# EAGLE board BORC_v2_control_board (EAGLE 9.6.2)
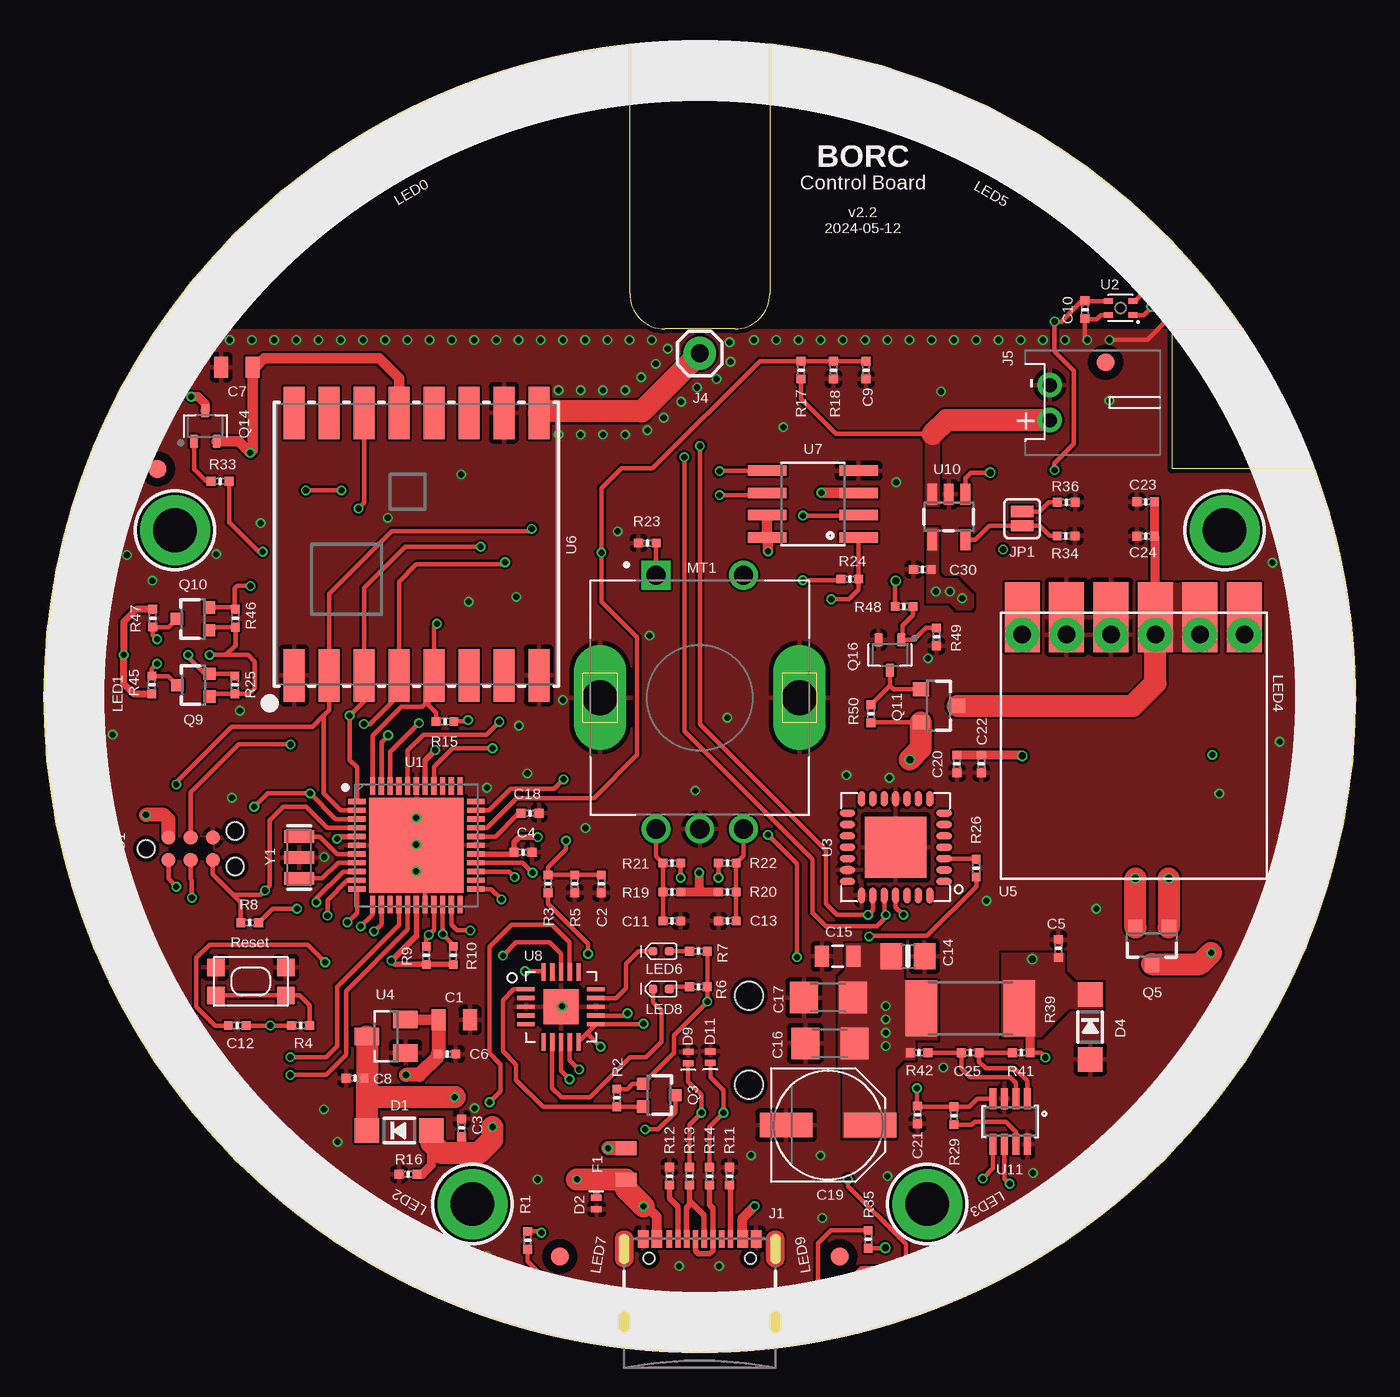
[diagram p4: board, top side]
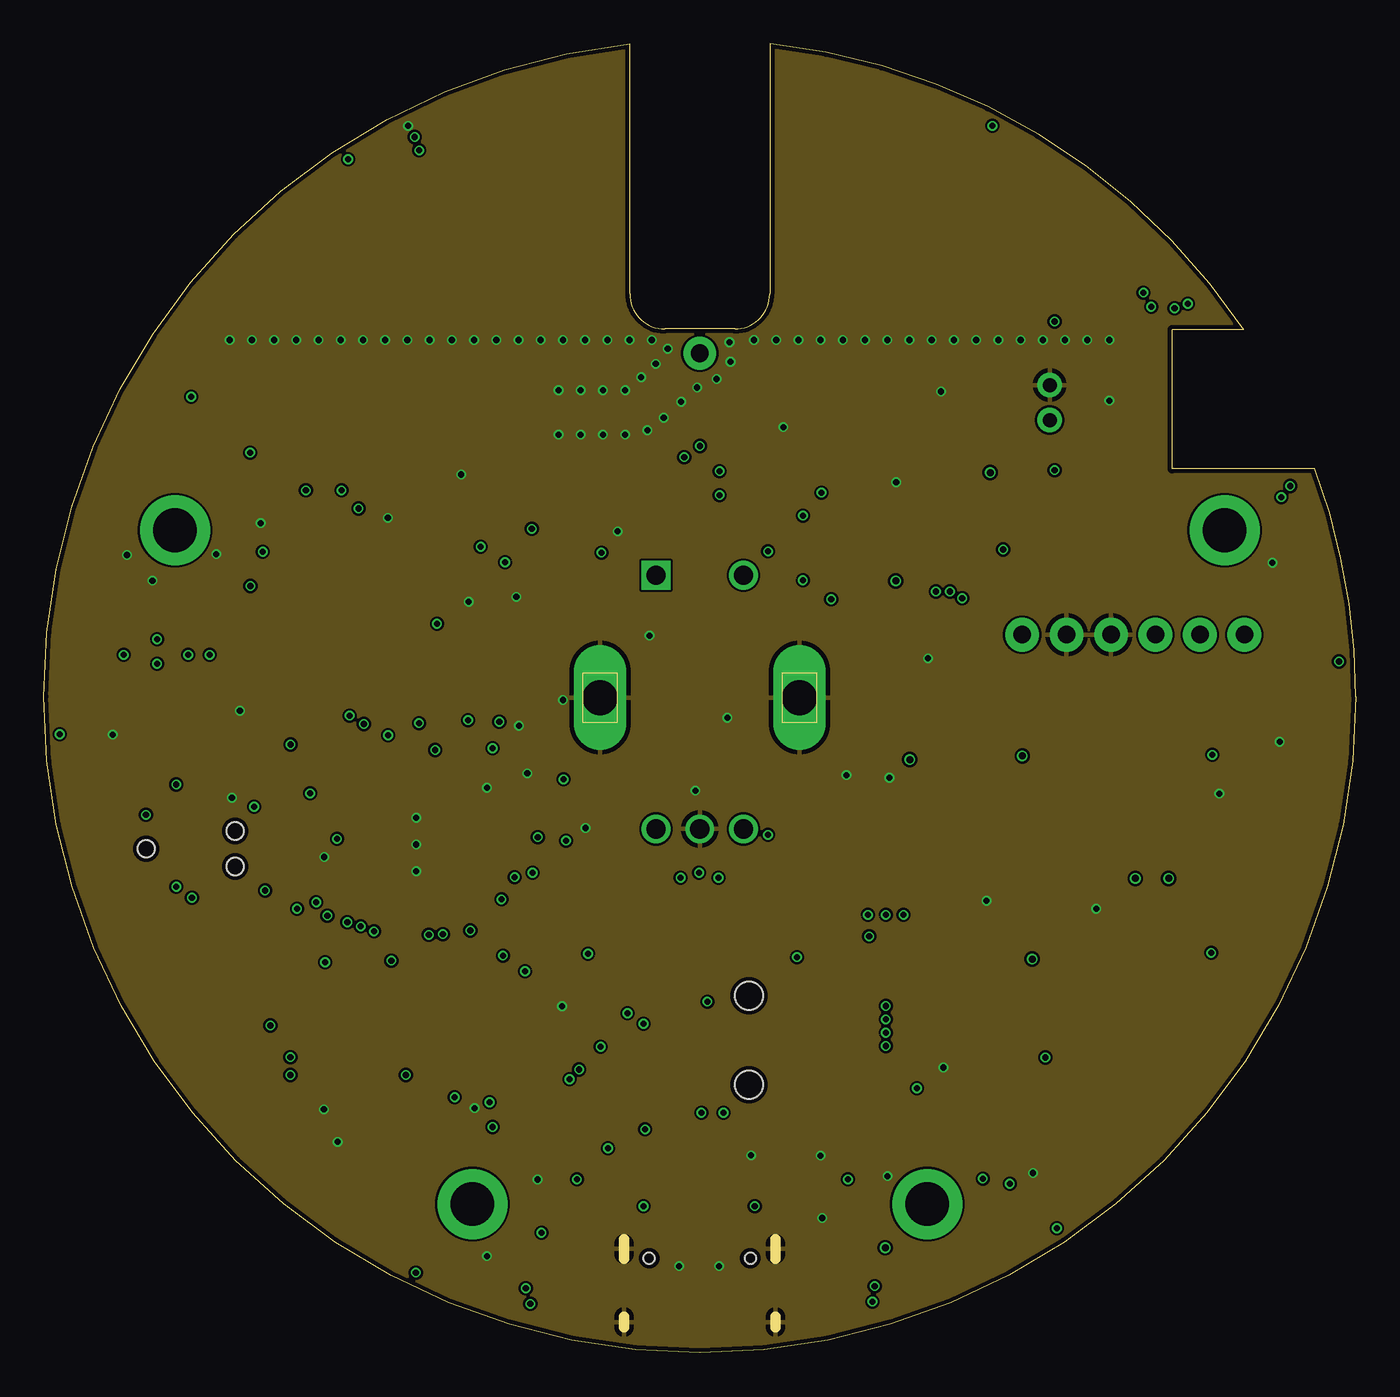
[diagram p5: board, inner layer Ground]
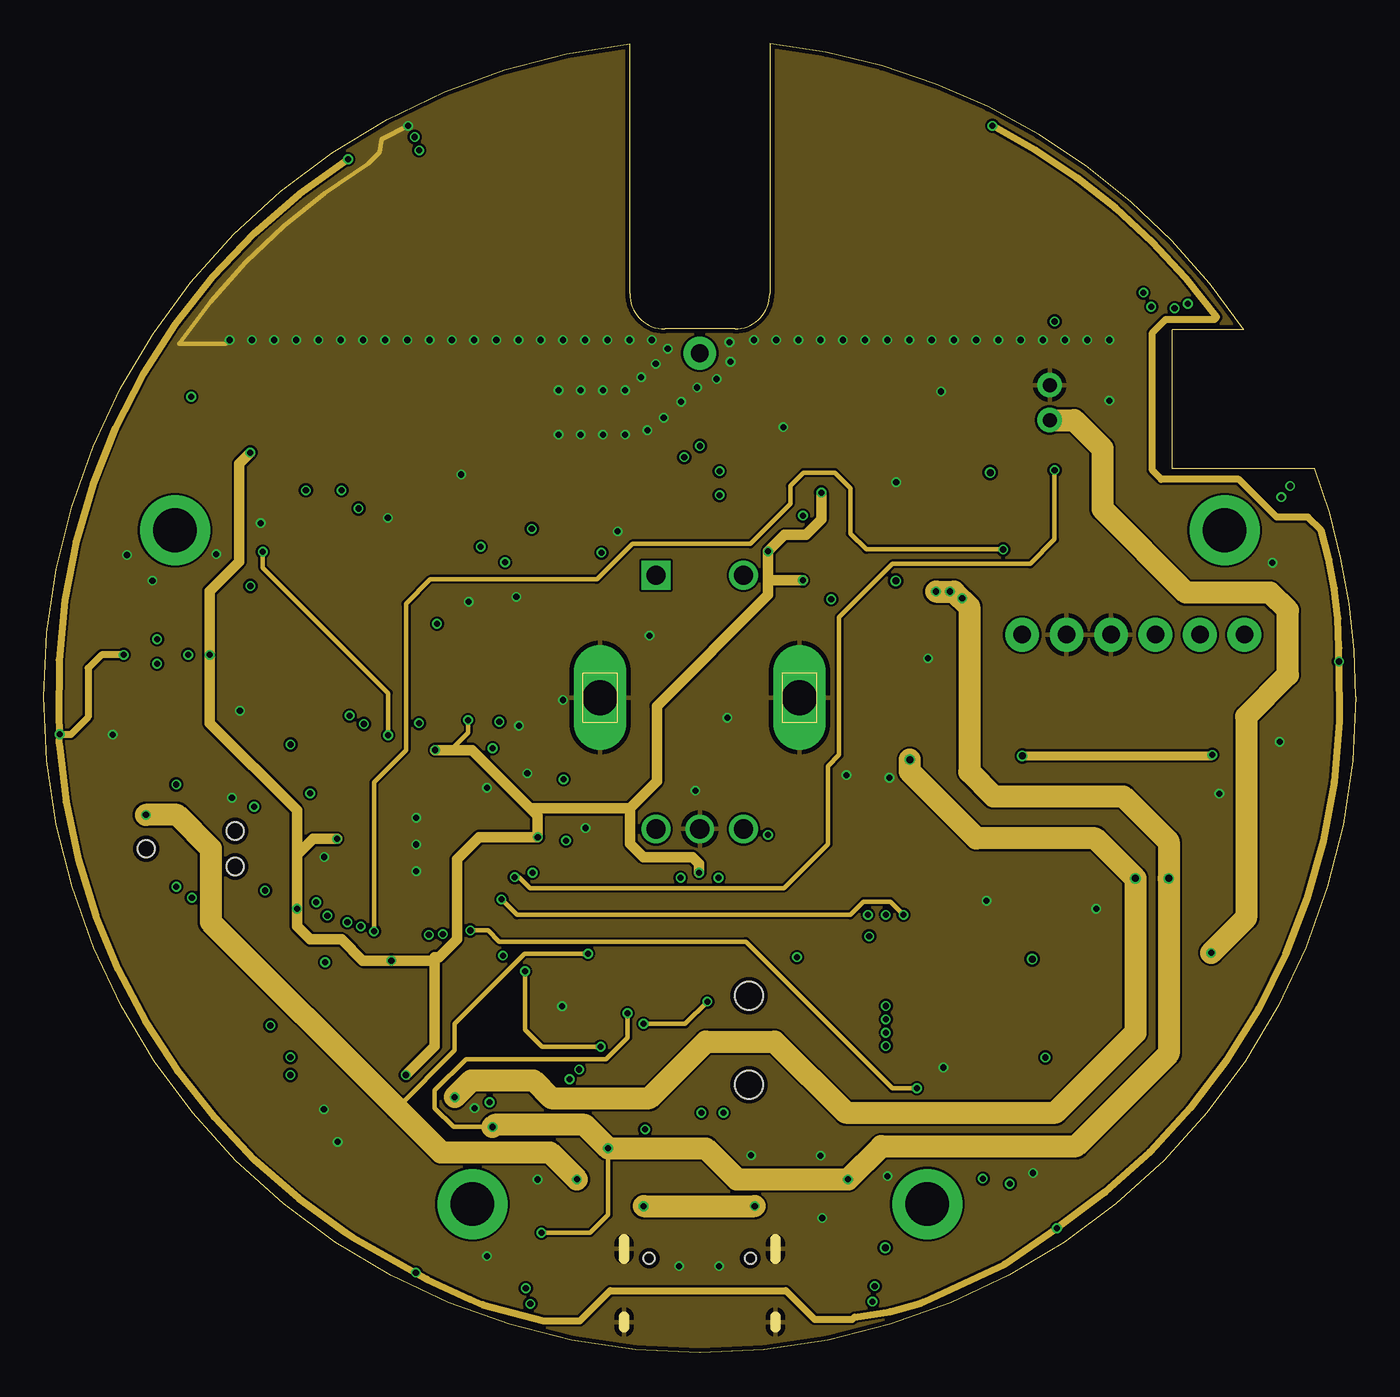
[diagram p6: board, inner layer Power]
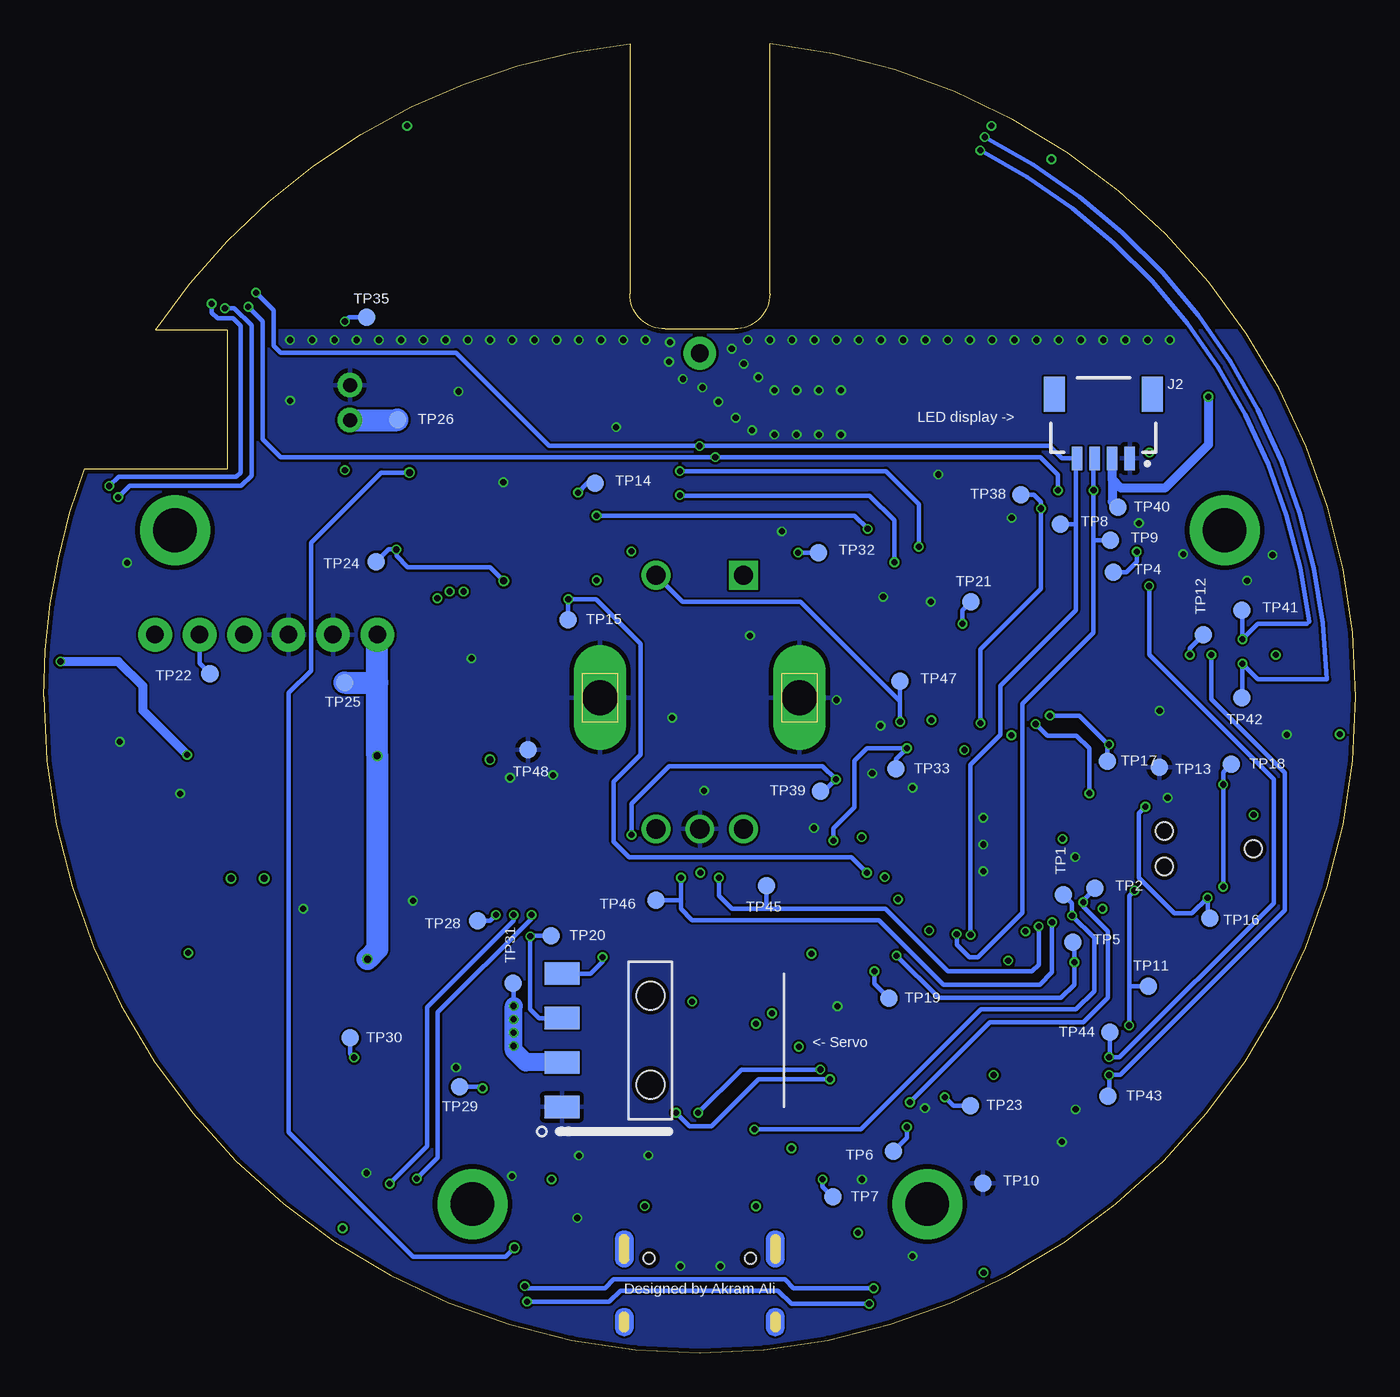
[diagram p7: board, bottom side, seen from below]

Size 75 x 74.8 mm. Coordinates in mm from the lower left corner, seen from the top.
Outline: 41.5,74.8 41.5,60.5 arc-90 39.5,58.5 35.5,58.5 arc-90 33.5,60.5 33.5,74.8 arc84 0,37.5 arc180 75,37.5 arc20 72.67,50.51 64.5,50.51 64.5,58.46 68.6,58.46 arc50 41.5,74.8
Copper layers (1*2*15*16): Top 0.035559375mm / dielectric 0.17018125mm / Ground 0.01778125mm / dielectric 47mil / Power 0.01778125mm / dielectric 0.17018125mm / Bottom 0.035559375mm
Design rules "oshpark-4layer *": minimum track width 5mil, minimum drill 10mil, track to track 5mil, track to pad 5mil, pad to pad 5mil, via to via 5mil, smd to smd 5mil, copper to edge 10mil, drill to drill 6mil, minimum pad ring 4mil, minimum via ring 4mil, stop-mask expansion 5mil, vias tented up to drill 15mil, thermal gap 10mil
Net classes: 0 default: width 0.152 mm, drill 0.305 mm, clearance 0.152 mm; 1 power: width 0.127 mm, clearance 0.127 mm
tRestrict: area 5.5,58.5 to 69.5,75.5
bRestrict: area 5.5,58.5 to 69.5,75.5

## Footprints (pad centres in the part's own frame; a part is rotated, then mirrored left to right if it is on the bottom)
0805 = smd 0.8 x 1.2: 1 -0.9,0; 2 0.9,0
MICROBUILDER__0402MP = smd 0.5 x 0.5: 1 -0.508,0; 2 0.508,0
0805-NO = smd 1.24 x 1.5: 1 -0.95,0; 2 0.95,0
1206 = smd 1.6 x 1.8: 1 -1.4,0; 2 1.4,0
PANASONIC_D = smd 3 x 1.4: + 2.4,0; - -2.4,0
SOD-123 = smd 1.4 x 1.4: A 1.85,0; C -1.85,0
0402 = smd 0.35 x 0.6: A -0.325,0; C 0.325,0
FIDUCIAL_1MM = smd 1 x 1: 1 0,0
USB-C-16P-2LAYER-PADS = smd 0.3 x 1: A5 -1.25,-0.34; A6 -0.25,-0.34; A7 0.25,-0.34; A8 1.25,-0.34; B5 1.75,-0.34; B6 0.75,-0.34; B7 -0.75,-0.34; B8 -1.75,-0.34 | smd 0.6 x 1: GND -3.225,-0.34; GND2 3.225,-0.34; VBUS1 -2.45,-0.34; VBUS2 2.45,-0.34 | drill 0.4 pad 0.6 long: SHLD1 -4.318,-0.915; SHLD2 4.318,-0.915; SHLD3 -4.318,-5.095; SHLD4 4.318,-5.095 | hole 0.65: -2.89,-1.445; 2.89,-1.445
JST04_1MM_RA = smd 0.6 x 1.35: 1 -1.5,0; 2 -0.5,0; 3 0.5,0; 4 1.5,0 | smd 1.2 x 2: NC1 2.8,-3.675; NC2 -2.8,-3.675
M20-8900405 = smd 1.27 x 2: P$1 -3.81,0; P$2 -1.27,0; P$3 1.27,0; P$4 3.81,0 | hole 1.6: -2.54,-5.07; 2.54,-5.07
1X01 = drill 1.016 pad 1.88: 1 0,0
JST-PH-2-THM-RA = drill 0.8 pad 1.422: 1 1,0; 2 -1,0
SMT-JUMPER_2_NC_PASTE_SILK = smd 0.635 x 1.27: 1 -0.406,0; 2 0.406,0
APA102_2020 = smd 0.7 x 0.35: 1 -0.95,-0.75; 2 -0.95,0; 3 -0.95,0.75; 4 0.95,0.75; 5 0.95,0; 6 0.95,-0.75
LED-0402 = smd 0.5 x 0.5: + -0.463,0; - 0.463,0
XDCR_PEC11R-4215F-S0024 = drill 1.1 square: 1 -2.5,7 | drill 1.1: 2 2.5,7; A -2.5,-7.5; B 2.5,-7.5; COM 0,-7.5 | drill 2 long: S1 -5.7,0; S2 5.7,0
SOT323 = smd 0.7 x 0.7: 1 -0.65,-0.925; 2 0.65,-0.925; 3 0,0.925
SOT23-3 = smd 0.8 x 0.9: 1 -0.95,-1; 2 0.95,-1; 3 0,1.1
SOT65P210X100-3N-PNP = smd 0.75 x 0.5: 1 -0.87,-0.65; 2 -0.87,0.65; 3 0.87,0
SOT65P210X100-3N = smd 0.75 x 0.5: 1 -0.87,0.65; 2 -0.87,-0.65; 3 0.87,0
2512 = smd 1.8 x 3.2: 1 -2.8,0; 2 2.8,0
KMR2 = smd 1 x 1: 1 2,0.8; 2 2,-0.8; 3 -2,0.8; 4 -2,-0.8
TC2030-IDC-NL = smd 0.787 x 0.787: 1 -1.27,-0.635; 2 -1.27,0.635; 3 0,-0.635; 4 0,0.635; 5 1.27,-0.635; 6 1.27,0.635 | hole 0.991: -2.54,0; 2.54,1.016; 2.54,-1.016
MICROBUILDER_TESTPOINT_ROUND_1MM = smd 1 x 1: P$1 0,0
QFN50P700X700X100-45N = smd 1 x 0.3: 1 -3.4,2.5; 2 -3.4,2; 3 -3.4,1.5; 4 -3.4,1; 5 -3.4,0.5; 6 -3.4,0; 7 -3.4,-0.5; 8 -3.4,-1; 9 -3.4,-1.5; 10 -3.4,-2; 11 -3.4,-2.5; 23 3.4,-2.5; 24 3.4,-2; 25 3.4,-1.5; 26 3.4,-1; 27 3.4,-0.5; 28 3.4,0; 29 3.4,0.5; 30 3.4,1; 31 3.4,1.5; 32 3.4,2; 33 3.4,2.5 | smd 0.3 x 1: 12 -2.5,-3.4; 13 -2,-3.4; 14 -1.5,-3.4; 15 -1,-3.4; 16 -0.5,-3.4; 17 0,-3.4; 18 0.5,-3.4; 19 1,-3.4; 20 1.5,-3.4; 21 2,-3.4; 22 2.5,-3.4; 34 2.5,3.4; 35 2,3.4; 36 1.5,3.4; 37 1,3.4; 38 0.5,3.4; 39 0,3.4; 40 -0.5,3.4; 41 -1,3.4; 42 -1.5,3.4; 43 -2,3.4; 44 -2.5,3.4 | smd 5.4 x 5.4: 45 0,0
SHT4X = smd 0.5 x 0.3: 1 -0.7,0.4; 2 -0.7,-0.4; 3 0.7,-0.4; 4 0.7,0.4
HVQFN28_SOT788-1 = smd 0.9 x 0.4: 1 1.035,5.76; 2 1.035,5.11; 3 1.035,4.46; 4 1.035,3.81; 5 1.035,3.16; 6 1.035,2.51; 7 1.035,1.86; 15 6.56,1.86; 16 6.56,2.51; 17 6.56,3.16; 18 6.56,3.81; 19 6.56,4.46; 20 6.56,5.11; 21 6.56,5.76 | smd 0.4 x 0.9: 8 1.86,1.035; 9 2.51,1.035; 10 3.16,1.035; 11 3.81,1.035; 12 4.46,1.035; 13 5.11,1.035; 14 5.76,1.035; 22 5.76,6.56; 23 5.11,6.56; 24 4.46,6.56; 25 3.81,6.56; 26 3.16,6.56; 27 2.51,6.56; 28 1.86,6.56 | smd 3.5 x 3.5: TH 3.81,3.81
SOT23 = smd 1 x 1.4: 1 -0.95,-1.1; 2 0.95,-1.1; 3 0,1.1
POLOLU_STEPUP_U3V40X = drill 1 pad 1.93: EN 1.27,1.27; GND@1 8.89,1.27; GND@2 11.43,1.27; VIN@1 3.81,1.27; VIN@2 6.35,1.27; VOUT 13.97,1.27 | smd 2 x 4: P$1 1.27,0.27; P$2 3.81,0.27; P$3 6.35,0.27; P$4 8.89,0.27; P$5 11.43,0.27; P$6 13.97,0.27
RFM69HCW-XXXS2 = smd 3 x 1.2: 1 -7.5,7; 2 -7.5,5; 3 -7.5,3; 4 -7.5,1; 5 -7.5,-1; 6 -7.5,-3; 7 -7.5,-5; 8 -7.5,-7; 9 7.5,-7; 10 7.5,-5; 11 7.5,-3; 12 7.5,-1; 13 7.5,1; 14 7.5,3; 15 7.5,5; 16 7.5,7
SO08 = smd 0.61 x 2.21: 1_CS -1.905,-2.616; 2_SO -0.635,-2.616; 3_WP 0.635,-2.616; 4_GND 1.905,-2.616; 5_SI 1.905,2.616; 6_SCK 0.635,2.616; 7_HOLD -0.635,2.616; 8_VCC -1.905,2.616
FTDI_FT231XQ-R_PACKAGE = smd 0.25 x 1: 3V3OUT 0.968,-2.032; CBUS2 -0.532,-2.032; CBUS3 0.968,1.968; CTS# -1.032,-2.032; DTR# -0.032,1.968; RTS# -0.532,1.968; TXD 0.468,1.968; USBDM 0.468,-2.032; USBDP -0.032,-2.032; VCCIO -1.032,1.968 | smd 1 x 0.25: CBUS0 1.968,0.968; CBUS1 1.968,0.468; DCD# -2.032,-1.032; DSR# -2.032,-0.532; GND_PIN3 -2.032,-0.032; GND_PIN13 1.968,-0.032; RESET# 1.968,-1.032; RI# -2.032,0.468; RXD -2.032,0.968; VCC 1.968,-0.532 | smd 2 x 2: GND_PIN21 -0.032,-0.032
SOT23-5 = smd 0.55 x 1.2: 1 -0.95,-1.3; 2 0,-1.3; 3 0.95,-1.3; 4 0.95,1.3; 5 -0.95,1.3
SOT23-8 = smd 0.4 x 1.2: 1 -0.975,-1.3; 2 -0.325,-1.3; 3 0.325,-1.3; 4 0.975,-1.3; 5 0.975,1.3; 6 0.325,1.3; 7 -0.325,1.3; 8 -0.975,1.3
MICROBUILDER_MOUNTINGHOLE_2.5_PLATED_THICK = drill 2.5 pad 4: P$1 0,0
RESONATOR-SMD = smd 0.7 x 1.7: 1 -1.2,0; 2 0,0; 3 1.2,0

## Placement (x,y rotation side)
C1  0.33µF  [0805]  23.46,19.03 0 top
C2  0.1uF  [MICROBUILDER__0402MP]  31.88,26.8 270 top
C3  0.1uF  [MICROBUILDER__0402MP]  23.89,12.86 90 top
C4  0.1uF  [MICROBUILDER__0402MP]  27.4,28.6 0 top
C5  0.1uF  [MICROBUILDER__0402MP]  58,23.1 90 top
C6  0.1uF  [MICROBUILDER__0402MP]  23.05,17.06 0 top
C7  0.33µF  [0805]  11.03,56.33 0 top
C8  10uF  [MICROBUILDER__0402MP]  17.79,15.69 180 top
C9  0.1uF  [MICROBUILDER__0402MP]  47,56.16 270 top
C10  0.1uF  [MICROBUILDER__0402MP]  59.52,59.61 270 top
C11  0.1uF  [MICROBUILDER__0402MP]  35.9,24.68 180 top
C12  0.1uF  [MICROBUILDER__0402MP]  11.06,18.7 0 top
C13  0.1uF  [MICROBUILDER__0402MP]  39.08,24.68 0 top
C14  0.1uF  [0805-NO]  49.4,22.66 0 top
C15  10uF  [0805]  45.39,22.65 180 top
C16  2.2uF  [1206]  44.93,17.68 180 top
C17  2.2uF  [1206]  44.85,20.29 180 top
C18  0.1uF  [MICROBUILDER__0402MP]  27.8,30.83 180 top
C19  100uF  [PANASONIC_D]  44.84,13.01 0 top
C20  10uF  [MICROBUILDER__0402MP]  52.2,33.66 270 top
C21  0.1uF  [MICROBUILDER__0402MP]  49.95,13.6 90 top
C22  10uF  [MICROBUILDER__0402MP]  53.59,33.66 270 top
C23  10uF  [MICROBUILDER__0402MP]  62.99,48.62 180 top
C24  10uF  [MICROBUILDER__0402MP]  62.99,46.66 180 top
C25  0.1uF  [MICROBUILDER__0402MP]  52.96,17.14 180 top
C30  10uF  [MICROBUILDER__0402MP]  50.22,44.76 180 top
D1  STPS140Z  [SOD-123]  20.32,12.7 0 top
D2  SP0402U-ULC-01ETG  [0402]  31.59,8.52 90 top
D4  MBR260HW  [SOD-123]  59.83,18.62 270 top
D9  SP0402U-ULC-01ETG  [0402]  36.83,16.87 270 top
D11  SP0402U-ULC-01ETG  [0402]  38.1,16.89 270 top
F1  6V 1.1A  [0805]  33.28,10.79 90 top
FID1  FIDUCIAL""  [FIDUCIAL_1MM]  45.5,5.5 0 top
FID2  FIDUCIAL""  [FIDUCIAL_1MM]  29.5,5.5 0 top
FID3  FIDUCIAL""  [FIDUCIAL_1MM]  6.5,50.5 0 top
FID4  FIDUCIAL""  [FIDUCIAL_1MM]  60.7,56.6 0 top
J1  USB Female Type C Connector  [USB-C-16P-2LAYER-PADS]  37.5,6.85 0 top
J2  QWIIC_RIGHT_ANGLE  [JST04_1MM_RA]  14.42,51.1 180 bottom
J3  M20-8900405  [M20-8900405]  45.38,17.86 90 bottom
J4  [1X01]  37.5,57.11 0 top
J5  [JST-PH-2-THM-RA]  57.5,54.3 270 top
JP1  JUMPER-SMT_2_NC_PASTE_SILK  [SMT-JUMPER_2_NC_PASTE_SILK]  55.93,47.66 270 top
LED0  APA102  [APA102_2020]  19.46,68.52 30 top
LED1  APA102  [APA102_2020]  1.67,37.52 90 top
LED2  APA102  [APA102_2020]  19.73,6.36 150 top
LED3  APA102  [APA102_2020]  55.38,6.4 210 top
LED4  APA102  [APA102_2020]  73.26,37.54 270 top
LED5  APA102  [APA102_2020]  55.63,68.46 330 top
LED6  RED  [LED-0402]  35.29,22.94 180 top
LED7  RED  [LED-0402]  30.23,1.45 350 top
LED8  GREEN  [LED-0402]  35.29,20.79 180 top
LED9  YELLOW  [LED-0402]  44.7,1.47 190 top
MT1  PEC11R-4215F-S0024  [XDCR_PEC11R-4215F-S0024]  37.5,37.43 0 top
Q3  BSS138PW,115  [SOT323]  35.18,14.72 270 top
Q5  SSM3J374R,LF  [SOT23-3]  63.35,23.3 180 top
Q9  BSS138PW,115  [SOT323]  8.56,38.15 90 top
Q10  BSS138PW,115  [SOT323]  8.54,41.94 90 top
Q11  SSM3J374R,LF  [SOT23-3]  51.14,36.97 270 top
Q14  UMT3906T106  [SOT65P210X100-3N-PNP]  9.24,52.95 90 top
Q16  UMT3904T106  [SOT65P210X100-3N]  48.37,39.87 270 top
R1  1K  [MICROBUILDER__0402MP]  27.66,6.42 270 top
R2  10K  [MICROBUILDER__0402MP]  32.76,14.56 270 top
R3  10M  [MICROBUILDER__0402MP]  28.83,26.8 270 top
R4  100  [MICROBUILDER__0402MP]  14.69,18.7 0 top
R5  10M  [MICROBUILDER__0402MP]  30.35,26.8 270 top
R6  1K  [MICROBUILDER__0402MP]  37.42,20.91 180 top
R7  1K  [MICROBUILDER__0402MP]  37.42,22.95 180 top
R8  10K  [MICROBUILDER__0402MP]  11.77,24.58 0 top
R9  4.7K  [MICROBUILDER__0402MP]  21.87,22.7 270 top
R10  4.7K  [MICROBUILDER__0402MP]  23.41,22.7 270 top
R11  5.1K  [MICROBUILDER__0402MP]  39.2,10.1 90 top
R12  5.1K  [MICROBUILDER__0402MP]  35.77,10.1 90 top
R13  27  [MICROBUILDER__0402MP]  36.92,10.1 270 top
R14  27  [MICROBUILDER__0402MP]  38.06,10.1 270 top
R15  10K  [MICROBUILDER__0402MP]  22.94,36.07 180 top
R16  10K  [MICROBUILDER__0402MP]  20.82,10.2 180 top
R17  10M  [MICROBUILDER__0402MP]  43.29,56.16 270 top
R18  10M  [MICROBUILDER__0402MP]  45.15,56.16 270 top
R19  10K  [MICROBUILDER__0402MP]  35.9,26.33 180 top
R20  10K  [MICROBUILDER__0402MP]  39.08,26.33 0 top
R21  10K  [MICROBUILDER__0402MP]  35.9,27.98 0 top
R22  10K  [MICROBUILDER__0402MP]  39.08,27.98 180 top
R23  10K  [MICROBUILDER__0402MP]  34.5,46.27 180 top
R24  10K  [MICROBUILDER__0402MP]  46.08,44.21 0 top
R25  10K  [MICROBUILDER__0402MP]  10.93,38.16 90 top
R26  220  [MICROBUILDER__0402MP]  53.3,27.69 90 top
R29  10K  [MICROBUILDER__0402MP]  52.03,13.54 270 top
R33  1K  [MICROBUILDER__0402MP]  10.09,49.8 0 top
R34  2K  [MICROBUILDER__0402MP]  58.43,46.67 180 top
R35  10K  [MICROBUILDER__0402MP]  47.13,6.48 270 top
R36  2K  [MICROBUILDER__0402MP]  58.45,48.6 180 top
R39  0.1/1%/2W  [2512]  52.96,19.68 0 top
R41  10  [MICROBUILDER__0402MP]  55.88,17.14 180 top
R42  10  [MICROBUILDER__0402MP]  50.04,17.14 0 top
R45  10K  [MICROBUILDER__0402MP]  6.18,38.16 90 top
R46  10K  [MICROBUILDER__0402MP]  10.96,41.97 90 top
R47  10K  [MICROBUILDER__0402MP]  6.23,41.98 270 top
R48  1K  [MICROBUILDER__0402MP]  49.17,42.64 180 top
R49  10K  [MICROBUILDER__0402MP]  51.03,40.91 270 top
R50  10K  [MICROBUILDER__0402MP]  47.28,36.52 90 top
SW1  SPST_TACT-KMR2  [KMR2]  11.84,21.22 180 top
TC1  TC2030-IDC-NL  [TC2030-IDC-NL]  8.4,28.8 0 top
TP1  TX  [MICROBUILDER_TESTPOINT_ROUND_1MM]  16.71,26.18 90 bottom
TP2  RX  [MICROBUILDER_TESTPOINT_ROUND_1MM]  14.91,26.53 0 bottom
TP4  RX  [MICROBUILDER_TESTPOINT_ROUND_1MM]  13.85,44.61 0 bottom
TP5  RX  [MICROBUILDER_TESTPOINT_ROUND_1MM]  16.18,23.46 0 bottom
TP6  RX  [MICROBUILDER_TESTPOINT_ROUND_1MM]  26.43,11.51 180 bottom
TP7  RX  [MICROBUILDER_TESTPOINT_ROUND_1MM]  29.89,8.9 0 bottom
TP8  RX  [MICROBUILDER_TESTPOINT_ROUND_1MM]  16.88,47.35 0 bottom
TP9  RX  [MICROBUILDER_TESTPOINT_ROUND_1MM]  14.02,46.42 0 bottom
TP10  RX  [MICROBUILDER_TESTPOINT_ROUND_1MM]  21.32,9.68 0 bottom
TP11  RX  [MICROBUILDER_TESTPOINT_ROUND_1MM]  11.86,20.94 0 bottom
TP12  RX  [MICROBUILDER_TESTPOINT_ROUND_1MM]  8.71,41.04 90 bottom
TP13  RX  [MICROBUILDER_TESTPOINT_ROUND_1MM]  11.23,33.45 0 bottom
TP14  RX  [MICROBUILDER_TESTPOINT_ROUND_1MM]  43.5,49.67 0 bottom
TP15  RX  [MICROBUILDER_TESTPOINT_ROUND_1MM]  45.03,41.88 0 bottom
TP16  RX  [MICROBUILDER_TESTPOINT_ROUND_1MM]  8.35,24.82 0 bottom
TP17  RX  [MICROBUILDER_TESTPOINT_ROUND_1MM]  14.21,33.8 0 bottom
TP18  RX  [MICROBUILDER_TESTPOINT_ROUND_1MM]  7.12,33.63 0 bottom
TP19  RX  [MICROBUILDER_TESTPOINT_ROUND_1MM]  26.7,20.26 0 bottom
TP20  RX  [MICROBUILDER_TESTPOINT_ROUND_1MM]  45.99,23.82 0 bottom
TP21  RX  [MICROBUILDER_TESTPOINT_ROUND_1MM]  22,42.91 0 bottom
TP22  RAW_PWR  [MICROBUILDER_TESTPOINT_ROUND_1MM]  65.5,38.8 180 bottom
TP23  RX  [MICROBUILDER_TESTPOINT_ROUND_1MM]  22.02,14.12 0 bottom
TP24  5V_POWER  [MICROBUILDER_TESTPOINT_ROUND_1MM]  56,45.2 180 bottom
TP25  RX  [MICROBUILDER_TESTPOINT_ROUND_1MM]  57.8,38.3 0 bottom
TP26  RX  [MICROBUILDER_TESTPOINT_ROUND_1MM]  54.78,53.32 0 bottom
TP28  RX  [MICROBUILDER_TESTPOINT_ROUND_1MM]  50.2,24.67 0 bottom
TP29  RX  [MICROBUILDER_TESTPOINT_ROUND_1MM]  51.23,15.19 0 bottom
TP30  RX  [MICROBUILDER_TESTPOINT_ROUND_1MM]  57.47,17.99 0 bottom
TP31  RX  [MICROBUILDER_TESTPOINT_ROUND_1MM]  48.17,21.12 90 bottom
TP32  RX  [MICROBUILDER_TESTPOINT_ROUND_1MM]  30.71,45.72 0 bottom
TP33  RX  [MICROBUILDER_TESTPOINT_ROUND_1MM]  26.29,33.36 0 bottom
TP35  RX  [MICROBUILDER_TESTPOINT_ROUND_1MM]  56.55,59.18 0 bottom
TP38  RX  [MICROBUILDER_TESTPOINT_ROUND_1MM]  19.14,49.03 0 bottom
TP39  RX  [MICROBUILDER_TESTPOINT_ROUND_1MM]  30.59,32.1 0 bottom
TP40  RX  [MICROBUILDER_TESTPOINT_ROUND_1MM]  13.6,48.31 0 bottom
TP41  RX  [MICROBUILDER_TESTPOINT_ROUND_1MM]  6.5,42.43 0 bottom
TP42  RX  [MICROBUILDER_TESTPOINT_ROUND_1MM]  6.52,37.43 0 bottom
TP43  RX  [MICROBUILDER_TESTPOINT_ROUND_1MM]  14.16,14.66 0 bottom
TP44  RX  [MICROBUILDER_TESTPOINT_ROUND_1MM]  14.05,18.3 0 bottom
TP45  RX  [MICROBUILDER_TESTPOINT_ROUND_1MM]  33.68,26.7 180 bottom
TP46  RX  [MICROBUILDER_TESTPOINT_ROUND_1MM]  40.01,25.85 180 bottom
TP47  RX  [MICROBUILDER_TESTPOINT_ROUND_1MM]  26.05,38.37 0 bottom
TP48  RX  [MICROBUILDER_TESTPOINT_ROUND_1MM]  47.31,34.45 0 bottom
U1  ATMEGA1284P-MU  [QFN50P700X700X100-45N]  21.3,29 0 top
U2  SHT40-BD1B  [SHT4X]  61.55,59.7 180 top
U3  PCA9685  [HVQFN28_SOT788-1]  52.51,32.7 180 top
U4  MCP1703CB  [SOT23]  19.57,18.08 90 top
U5  POLOLU_STEPUP_U3V40F5  [POLOLU_STEPUP_U3V40X]  69.9,42.3 180 top
U6  915MHz  [RFM69HCW-XXXS2]  21.31,46.2 90 top
U7  AT25F512BJEDEC_3.9MM  [SO08]  43.97,48.5 90 top
U8  FT231XQ-R  [FTDI_FT231XQ-R_PACKAGE]  29.6,19.8 0 top
U10  MCP73831  [SOT23-5]  51.73,47.77 180 top
U11  INA219AIDCNR  [SOT23-8]  55.24,13.21 180 top
U$8  MICROBUILDER_MOUNTINGHOLE2.5_THICK  [MICROBUILDER_MOUNTINGHOLE_2.5_PLATED_THICK]  24.5,8.5 0 top
U$9  MICROBUILDER_MOUNTINGHOLE2.5_THICK  [MICROBUILDER_MOUNTINGHOLE_2.5_PLATED_THICK]  50.5,8.5 0 top
U$10  MICROBUILDER_MOUNTINGHOLE2.5_THICK  [MICROBUILDER_MOUNTINGHOLE_2.5_PLATED_THICK]  67.5,47 0 top
U$11  MICROBUILDER_MOUNTINGHOLE2.5_THICK  [MICROBUILDER_MOUNTINGHOLE_2.5_PLATED_THICK]  7.5,47 0 top
Y1  16 MHz  [RESONATOR-SMD]  14.6,28.3 90 top

## Tracks (layer width: path | path; a pad name or v marks a point on that pad's centre or on a via)
5V  (via drill 0.35, 0.4)
  Top 0.254: R41.1 56.99,17.14 v57.26,16.87
  Top 0.406: R47.1 5.27,42.48 4.57,41.78 v4.57,39.88 4.57,38.23 5.15,37.65 R45.1 | LED4.3 v74.04,39.5 | LED5.3 v54.23,70.1 | LED3.3 v57.91,7.11 | LED2.3 v21.27,4.58 | LED1.3 v0.92,35.34 | v17.4,68.2 LED0.3
  Top 0.508: R41.1 56.39,19.06 R39.2 | C20.1 C22.1 55.87,34.16 v55.93,34.1
  Power 0.406: v54.23,70.1 arc-27 67.06,59.18 66.93,59.05 64.14,59.05 63.37,58.29 63.37,50.42 63.88,49.91 68.33,49.91 70.48,47.75 72.26,47.75 73.03,46.99 arc-17 74.04,40.26 v74.04,39.5 arc-59 v57.91,7.11 54.94,5.06 50.31,2.9 | 50.31,2.9 50.12,2.81 48.38,2.35 46.35,2.03 46.23,1.91 44.07,1.91 42.42,3.56 32.38,3.56 30.66,1.83 28.56,1.83 25.1,2.76 24.38,3.05 21.89,4.21 v21.27,4.58 17.65,6.6 17.27,6.86 arc-52 0.89,34.8 v0.92,35.34 | 50.31,2.9 | v4.57,39.88 3.3,39.88 2.54,39.12 2.54,36.32 1.56,35.34 v0.92,35.34 | v17.4,68.2 arc60 0.87,36.14 v0.92,35.34
  Power 0.508: v55.93,34.1 66.74,34.1 v66.8,34.16
  Bottom 0.254: TP30.P$1 57.47,17.09 v57.26,16.87
  Bottom 0.508: v66.8,34.16 69.34,36.7 69.34,38.1 70.74,39.5 v74.04,39.5
  Bottom 1.27: v56.5,22.5 55.93,23.07 v55.93,34.1 55.93,38.3 | 55.93,38.3 U5.VOUT | TP25.P$1 55.93,38.3
  pour Top (no thermals): 54.99,43.95 56.9,43.95 56.9,40.51 54.99,40.51
  pour Top (no thermals): 54.8,21.3 54.8,18.1 57,18.1 58.6,19.7 60.5,19.7 60.5,21.1 58.9,21.1 58.3,21.7 58.3,22.8 54.8,22.8
5V_POWER  (via drill 0.35, 0.4)
  Top 0.254: U1.13 19.3,24.5 v18.88,24.08 | v48.7,44.1 48.67,44.07 R48.2
  Power 0.254: v18.88,24.08 18.88,32.59 20.7,34.42 20.7,42.8 22.1,44.2 31.62,44.2 33.66,46.23 40.39,46.23 42.68,48.51 42.68,49.53 43.44,50.29 45.22,50.29 46.11,49.4 46.11,46.81 47.02,45.9 v54.84,45.9
  Bottom 0.254: TP24.P$1 55.3,45.9 v54.84,45.9 54.84,45.54 54.2,44.9 49.5,44.9 v48.7,44.1
A
  Top 0.254: C11.2 R19.2 R21.1 35,28.37 MT1.A
ANT
  Top 1.27: J4.1 34.19,53.8 28.41,53.8 U6.9
B
  Top 0.254: C13.2 R20.2 R22.1 40,28.4 MT1.B
C2
  Top 0.254: LED1.5 1.67,38.4 arc-45 1.65,38.35 arc-58 18.67,68.07 18.65,68.06 arc-45 LED0.2
C3
  Top 0.254: LED2.5 18.91,6.85 18.92,6.86 arc-57 1.65,36.58 arc45 1.65,36.58 LED1.2 | LED2.5
C4  (via drill 0.35)
  Top 0.254: LED2.2 20.96,5.65 arc15 v27.81,2.79 | LED3.5 54.46,5.92 arc-20 v47.37,2.92
  Bottom 0.254: v27.81,2.79 32.26,2.79 33.02,3.56 42.04,3.56 42.67,2.92 v47.37,2.92
C5
  Top 0.254: LED4.5 73.28,36.58 73.28,36.58 arc-57 56.13,6.86 56.17,6.86 arc45 LED3.2
C6  (via drill 0.35)
  Top 0.254: v65.41,59.94 arc19 56.52,67.94 56.48,67.97 arc45 LED5.5 | v71.25,49.53 arc-25 73.28,40.39 73.28,38.61 arc45 73.26,38.57 LED4.2
  Bottom 0.254: v65.41,59.94 65.41,59.44 65.07,59.1 64.17,59.1 63.74,58.67 63.74,50.3 63.99,50.05 70.73,50.05 v71.25,49.53
CHANNEL_A  (via drill 0.35)
  Top 0.254: U1.12 18.8,25.04 v18.12,24.36 | R21.2 v36.41,27.14
  Bottom 0.254: v18.12,24.36 18.12,22.18 18.5,21.8 23.33,21.8 26.88,25.36 33.66,25.36 | 33.66,25.36 35.65,25.36 36.41,26.12 v36.41,27.14 | TP45.P$1 33.68,25.39 33.66,25.36
CHANNEL_B  (via drill 0.35)
  Top 0.254: U1.11 17.9,25.14 v17.36,24.6 | R22.2 v38.57,27.14
  Bottom 0.254: v17.36,24.6 17.36,21.74 18.05,21.04 23.58,21.04 27.27,24.73 37.93,24.73 38.57,25.36 38.57,25.78 | 38.57,25.78 v38.57,27.14 | 38.57,25.78 38.64,25.85 TP46.P$1
CURRENT_SENSE_POWER  (via drill 0.35)
  Top 0.254: U1.21 23.3,24.45 23.62,24.13 v24.38,24.13 | U11.4 53.38,14.51 52.93,14.05 R29.1 50,14.05 C21.2 49.91,14.11 v49.91,15.11
  Power 0.254: v24.38,24.13 25.4,24.13 26.04,23.5 40.13,23.5 48.51,15.11 v49.91,15.11
  Bottom 0.254: TP29.P$1 49.99,15.19 v49.91,15.11
D2
  Top 0.254: LED0.1 arc-45 LED0.1 19.05,67.44 arc57 2.41,38.48 LED1.6 arc45 LED1.6
D3
  Top 0.254: LED1.1 2.41,36.58 2.41,36.7 arc57 19.3,7.49 arc45 LED2.6 | LED2.6
D4  (via drill 0.35)
  Top 0.254: LED3.6 54.09,6.57 arc-22 v47.5,3.81 | LED2.1 22.59,5.61 arc16 v27.56,3.68 | LED3.6
  Bottom 0.254: v47.5,3.81 47.37,3.68 42.93,3.68 42.42,4.19 32.64,4.19 32.13,3.68 v27.56,3.68
D5
  Top 0.254: LED4.6 72.52,36.58 arc-57 55.75,7.49 55.76,7.49 arc45 LED3.1
D6  (via drill 0.35)
  Top 0.254: v64.64,59.69 arc19 56.13,67.31 56.12,67.32 arc45 LED5.6 | v70.74,48.9 arc-24 72.52,40.53 LED4.1 arc-45 LED4.1
  Bottom 0.254: v64.64,59.69 64.1,59.69 63.13,58.72 63.13,50.12 63.7,49.54 70.09,49.54 v70.74,48.9
D+  (via drill 0.35)
  Top 0.254: U8.USBDP 29.57,16.12 v30.06,15.63 | R14.1 38.06,12.91 v38.86,13.72 38.86,14.99 38.1,15.75 D11.C
  Bottom 0.254: v30.06,15.63 34.16,15.63 36.83,12.95 38.1,12.95 v38.86,13.72
D-  (via drill 0.35)
  Top 0.254: R13.1 36.92,13.04 v37.59,13.72 37.59,14.73 36.83,15.49 D9.C | U8.USBDM 30.07,16.72 v30.61,16.18
  Bottom 0.254: v37.59,13.72 35.12,16.18 v30.61,16.18
DIO0  (via drill 0.35)
  Top 0.254: v21.45,35.98 21.42,35.98 19.8,34.35 U1.42 | U6.14 18.31,48.56 v17.99,48.24
  Bottom 0.254: v21.45,35.98 21.45,40.19 17.99,43.65 v17.99,48.24 17.99,48.63 18.4,49.03 TP38.P$1
DISPLAY_3V3  (via drill 0.35)
  Top 0.508: Q14.3 9.22,53.84 9.22,54.23 8.82,54.63 v8.43,54.63
  Bottom 0.508: v8.43,54.63 8.43,51.9 10.92,49.4 13.42,49.4 13.92,49.91 | 13.92,49.91 J2.2 | 13.92,49.91 13.92,48.64 TP40.P$1
DISPLAY_POWER  (via drill 0.35)
  Top 0.254: U1.43 19.3,34.89 v19.69,35.28 | v12.52,45.77 12.28,45.77 10.59,47.46 R33.2
  Power 0.254: v19.69,35.28 19.69,37.69 12.52,44.86 v12.52,45.77
  Bottom 0.254: v12.52,45.77 12.52,45.21 13.12,44.61 TP4.P$1
DRIVER_POWER  (via drill 0.35)
  Top 0.254: U1.23 25.57,26.5 v26.16,25.91 | U3.25 48.7,25.47 v49.15,25.02
  Power 0.254: v26.16,25.91 27.05,25.02 46.1,25.02 46.86,25.78 48.39,25.78 v49.15,25.02
  Bottom 0.254: v49.15,25.02 49.49,24.67 TP28.P$1
DTR  (via drill 0.35)
  Top 0.254: U8.DTR# 29.57,22.8 28.92,23.45 27.01,23.45 v26.25,22.69 | v16.09,22.31 15.07,23.33 9.48,23.33 8.72,22.57 8.72,19.77 9.79,18.7 C12.1
  Bottom 0.254: v26.25,22.69 23.84,20.28 16.85,20.28 16.09,21.04 v16.09,22.31 16.09,23.37 TP5.P$1
FLASH_CS  (via drill 0.35)
  Top 0.254: U1.26 27.37,28 v27.94,27.43 | R24.2 | R24.2 46.58,43.6 46.03,43.05 v45.02,43.05 | R24.2 U7.1_CS
  Bottom 0.254: v27.94,27.43 28.83,28.32 41.53,28.32 42.42,29.21 42.42,32.64 40.89,34.16 40.89,40.51 43.43,43.05 v45.02,43.05 45.03,43.03 TP15.P$1
FTDI_3.3V  (via drill 0.35)
  Top 0.254: 31.06,18.26 U8.RESET# 34.26,18.77 v34.29,18.8 | 31.06,18.26 U8.3V3OUT | U8.VCCIO 28.57,21.8 v27.52,21.8 | v31.84,17.49 31.06,18.26 | R2.1 33.36,15.07 33.66,15.37 Q3.1 36.02,17.14 36.02,18.16 v37.93,20.07 R6.1 R7.1
  Power 0.254: v27.52,21.8 27.52,18.45 28.49,17.49 v31.84,17.49 | v34.29,18.8 36.66,18.8 v37.93,20.07
  Bottom 0.254: v27.52,21.8 27.52,21.08 TP19.P$1
GND  (via drill 0.35)
  Top 0.254: U1.18 21.8,27.02 v21.3,27.52 | v60.92,57.87 63.08,57.87 64.26,59.05 66.29,59.05 66.55,59.31 66.55,59.94 66.29,60.2 arc20 56.9,68.58 LED5.4 | U2.4 60.44,59.3 60.2,59.05 59.56,59.05 C10.2 59.52,58 v59.65,57.87 | LED0.4 v20.83,70.1
  Power 0.254: v20.83,70.1 19.3,69.34 19.2,68.6 18.54,67.94 arc24 7.75,57.66 10.41,57.66 v10.63,57.87
  other vias: 10.76,31.71 21.3,29.04 27.14,57.87 28.41,57.87 29.68,57.87 30.95,57.87 32.22,57.87 33.49,57.87 16.98,57.87 15.71,57.87 14.44,57.87 13.17,57.87 11.9,57.87 34.63,40.98 19.67,47.71 23.87,50.18 6.21,44.12 60.16,25.37 42.28,52.89 53.89,25.82 24.62,13.98 16.01,13.9 25.33,5.52 28.23,9.9 36.32,4.95 38.61,4.95 50.55,39.68 44.5,7.7 16.04,28.33 70.65,34.91 45.88,33.01 29.63,19.8 29.68,37.3 27.01,43.19 3.94,35.32 21.3,30.57 44.41,11.26 32.81,46.93 4.76,45.59 9.87,45.63 29.42,52.47 30.69,52.47 31.96,52.47 33.23,52.47 34.5,52.72 33.23,55.01 31.96,55.01 30.69,55.01 29.42,55.01 27.16,35.82 12.4,47.41 16.8,12.05 11.21,36.69 24.29,42.91 48.35,32.85 39.08,36.28 40.44,11.28 67.2,31.95 48.24,10.1 60.91,54.41 70.24,45.15 48.73,49.74 51.29,54.93 37.25,32.12 56.55,10.27 27.65,33.11 18.25,57.87 19.52,57.87 20.79,57.87 22.06,57.87 23.33,57.87 24.6,57.87 25.87,57.87 34.76,57.87 34.99,56.5 35.44,53.43 36.43,54.34 37.35,55.16 38.47,55.64 34.15,55.74 35.67,57.37 39.25,56.63 39.2,57.74 40.6,57.87 41.87,57.87 43.14,57.87 44.41,57.87 45.68,57.87 46.95,57.87 48.22,57.87 49.49,57.87 50.76,57.87 52.03,57.87 53.3,57.87 54.57,57.87 55.84,57.87 57.11,57.87 58.38,57.87 25.34,32.29 30.97,29.98 51.43,16.3
  pour Top (rank 6): -0.5,37.5 arc90 37.5,-0.5 arc90 75.5,37.5 arc90 37.5,75.5 arc90
  pour Ground: -0.5,37.5 arc90 37.5,-0.5 arc90 75.5,37.5 arc90 37.5,75.5 arc90
  pour Power: -0.5,37.5 arc90 37.5,-0.5 arc90 75.5,37.5 arc90 37.5,75.5 arc90
  pour Bottom (rank 6): -0.5,37.5 arc90 37.5,-0.5 arc90 75.5,37.5 arc90 37.5,75.5 arc90
KNOB  (via drill 0.35)
  Top 0.254: U1.40 20.8,34.41 21.7,35.32 25.31,35.32 v26.05,36.05
  Bottom 0.254: MT1.2 38.5,42.93 31.75,42.93 26.05,37.22 | 26.05,37.22 v26.05,36.05 | 26.05,37.22 TP47.P$1
LED_CLK  (via drill 0.35)
  Top 0.254: R25.2 10.8,38.8 Q9.2 9.21,38.8 8.26,39.75 v8.26,39.88 | U1.16 20.8,24.19 17.27,20.67 17.27,17.02 16.13,15.88 v14.1,15.88
  Bottom 0.254: v8.26,39.88 8.26,37.34 4.06,33.15 4.06,25.27 13.46,15.88 v14.1,15.88 14.1,14.72 TP43.P$1
LED_CLK_5V  (via drill 0.35)
  Top 0.254: LED0.5 v21.21,69.47 | v6.48,39.37 6.18,39.07 R45.2 7.12,38.67 Q9.3
  Bottom 0.254: v21.21,69.47 arc61 1.65,38.48 5.59,38.48 v6.48,39.37 6.48,37.48 TP42.P$1
LED_DATA  (via drill 0.35)
  Top 0.254: Q10.2 10.85,42.59 R46.2 10.92,42.52 10.92,43.69 11.05,43.81 v11.81,43.81 | U1.15 20.3,24.46 16.76,20.92 16.76,17.53 16.13,16.89 v14.1,16.89
  Bottom 0.254: v11.81,43.81 11.81,39.88 4.7,32.77 4.7,25.7 13.51,16.89 v14.1,16.89 14.05,16.94 TP44.P$1
LED_DATA_5V  (via drill 0.35)
  Top 0.254: v6.48,40.77 6.23,41.01 R47.2 7.14,41.47 Q10.3 | LED0.6 v21.46,68.71
  Bottom 0.254: v21.46,68.71 arc56 2.67,41.78 2.79,41.66 5.59,41.66 v6.48,40.77 6.48,42.4 TP41.P$1
MISO  (via drill 0.35)
  Top 0.254: TC1.1 7.13,27.08 v7.58,26.63 | v7.58,32.47 7.58,32.6 10.76,35.77 15.36,35.77 16.01,36.42 | U7.2_SO 46.55,47.84 v43.4,47.84 | v27.9,47.08 27.77,46.95 19.9,46.95 16.31,43.36 U6.2 16.31,36.72 16.01,36.42 | U1.2 16.98,31 16.01,31.97 16.01,36.42
  Bottom 0.254: v7.58,26.63 v7.58,32.47 7.58,33.17 TP18.P$1 | v27.9,47.08 28.66,47.84 v43.4,47.84
MOSI  (via drill 0.35)
  Top 0.254: TC1.4 8.4,32.02 11.14,34.76 v14.11,34.76 | U7.5_SI 38.66,50.41 v38.63,50.38 | v24.98,46.06 20.66,46.06 18.31,43.71 U6.3 18.31,37.23 v17.49,36.41 17.49,33.87 17.9,33.45 U1.1
  Bottom 0.254: v17.49,36.41 15.81,36.41 14.16,34.76 v14.11,34.76 14.21,34.65 TP17.P$1 | v24.98,46.06 24.98,48.5 26.86,50.38 v38.63,50.38
N$1
  Top 0.254: U1.8 16.82,28 15.92,27.1 Y1.1
N$2
  Top 0.254: R1.2 27.66,5.23 29.77,3.12 LED7.+
N$3
  Top 0.254: U1.7 16.77,28.5 15.77,29.5 Y1.3
N$4
  Top 0.305: J1.B5 39.25,9.54 R11.1
N$5
  Top 0.305: J1.A5 36.25,8.35 35.77,8.83 R12.1
N$6
  Top 0.254: R6.2 35.88,20.91 LED8.+
N$7
  Top 0.254: U8.CBUS1 32.71,20.27 33.27,20.83 33.27,22.23 33.99,22.94 LED6.-
N$8
  Top 0.254: U1.29 25.82,29.5 27.14,30.83 C18.2
N$9  (via drill 0.4)
  Top 0.254: R35.2 48.07,5.97 v48.1,6 | v54.1,50.3 53,50.3 52.68,49.98 U10.1
  Bottom 0.254: v48.1,6 48.6,5.5 53.9,5.5 61,12.6 61,37.7 59.72,38.98 59.72,46.28 55.7,50.3 v54.1,50.3
N$10
  Top 0.254: U8.CBUS2 29.07,15.13 29.59,14.61 31.24,14.61 33.53,16.89 34.42,16.89 35.31,17.78 35.31,19.56 34.83,20.04 LED8.-
N$11
  Top 0.254: R23.1 35.01,44.44 MT1.1
N$12
  Top 0.254: SW1.1 SW1.3 14.63,20.42 15.19,19.86 R4.2
N$13
  Top 0.254: R26.2 53.27,28.24 U3.3
N$14
  Top 0.254: U8.RXD 26.86,20.77 26.25,20.15 26.25,17.23 27.01,16.47 27.01,15.58 28.54,14.05 R2.2 34.24,14.05 Q3.2
N$15
  Top 0.254: R29.2 53.04,13.04 53.21,13.21 54.99,13.21 55.57,12.63 U11.7
N$16
  Top 0.254: LED9.- 44.25,6.25 44.99,6.99 R35.1
N$17
  Top 0.254: R7.2 LED6.+
N$19
  Top 0.254: Q14.2 8.59,50.48 9.28,49.8 R33.1
N$21
  Top 0.254: U10.5 53.27,46.47 54.06,47.26 JP1.2 56.94,47.26 57.52,46.67 R34.2
N$22
  Top 0.254: JP1.1 56.91,48.07 57.44,48.6 R36.2
N$24
  Top 0.254: Q16.3 48.37,38.11 | 48.37,38.11 R50.2 | 48.37,38.11 48.56,37.92 Q11.1
N$45
  Top 0.254: R49.1 50.43,41.42 49.76,40.74 Q16.1 49.08,40.8 49.08,41.54 49.68,42.14 R48.1
RADIO_CS  (via drill 0.35)
  Top 0.254: 22.01,37.3 22.31,37.6 U6.5 22.31,41.48 v22.48,41.66 | 22.01,37.3 21.61,36.91 20.43,36.91 18.8,35.27 U1.44 | 22.01,37.3 22.01,36.99 22.43,36.57 R15.2
  Bottom 0.254: v22.48,41.66 22.48,42.43 TP21.P$1
RAW_PWR
  Top 0.508: C23.1 C24.1 63.5,41.08 U5.VIN@2
  Top 1.27: Q11.3 62.27,36.97 63.55,38.25 U5.VIN@2
  Bottom 0.254: TP22.P$1 66.09,39.39 U5.VIN@1
  pour Top (no thermals): 62.61,43.95 67.06,43.95 67.06,40.11 62.61,40.11
RESET  (via drill 0.35)
  Top 0.254: TC1.5 9.67,27.33 10.83,26.17 | 10.83,26.17 12.41,26.17 v12.65,26.42 12.91,26.68 12.91,30.44 13.68,31.2 15.01,31.2 16.21,30 U1.4 | R4.1 v12.95,18.7 C12.2 | 10.83,26.17 11.27,25.74 R8.1
  Bottom 0.254: v12.95,18.7 12.95,20.95 | 12.95,20.95 12.95,26.11 v12.65,26.41 v12.65,26.42 | TP11.P$1 12.94,20.94 12.95,20.95
RX  (via drill 0.35)
  Top 0.254: U8.TXD 30.07,23.45 29.04,24.47 26.76,24.47 25.49,23.2 25.49,17.11 26.12,16.47 26.12,14.95 v25.49,14.31 | U1.9 17.12,27.5 15.58,25.96 v15.58,25.74
  Bottom 0.254: v25.49,14.31 20.91,18.88 15.58,18.88 14.18,20.28 14.18,24.09 15.58,25.49 v15.58,25.74 15.58,25.86 TP2.P$1
SCK  (via drill 0.35)
  Top 0.254: v18.3,35.93 18.63,35.93 20.31,37.6 U6.4 20.31,44.06 21.3,45.05 26.25,45.05 v26.38,45.17 | TC1.3 8.4,27.08 8.47,27.01 v8.47,26 | U7.6_SCK 41.35,49.01 v38.63,49.01 | v12.03,31.2 12.79,31.96 v15.23,31.96 16.69,30.5 U1.3
  Bottom 0.254: v18.3,35.93 17.64,35.27 15.96,35.27 15.22,34.53 v15.22,31.97 v15.23,31.96 | v38.63,49.01 38.61,48.98 27.8,48.98 26.38,47.56 v26.38,45.17 | v12.03,31.2 12.41,30.82 12.41,27.14 10.37,25.11 9.36,25.11 v8.47,26 8.47,24.94 TP16.P$1
SCL  (via drill 0.35)
  Top 0.254: U1.19 22.3,24.16 v22.02,23.88 21.87,23.73 R9.1 | U2.2 62.38,60.1 v62.87,60.58 | U3.23 47.4,25.3 v47.12,25.02 45.34,25.02 44.7,25.65 44.7,28.7 37.51,35.9 v37.51,51.82 | v53.68,9.95 54.27,10.54 U11.5
  Bottom 0.254: v22.02,23.88 22.02,33.61 20.32,35.31 20.32,38.1 16,42.42 16,47.37 | 16,47.37 16,51.02 J2.4 16.81,51.1 17.53,51.82 v37.51,51.82 46.1,51.82 51.44,57.15 61.47,57.15 61.85,57.53 61.85,59.56 v62.87,60.58 | v47.12,25.02 47.12,24.81 52.48,19.45 52.48,11.15 v53.68,9.95 | TP8.P$1 16.03,47.35 16,47.37
SDA  (via drill 0.35)
  Top 0.254: U1.20 22.8,23.94 v22.81,23.92 23.41,23.33 R10.1 | v63.3,59.77 63.3,59.72 62.88,59.3 U2.1 | U3.24 48.05,25.11 v48.13,25.02 48.13,24.89 47.62,24.38 44.7,24.38 43.94,25.15 43.94,28.19 36.62,35.52 v36.62,51.18 | U11.6 54.92,9.95 v55.22,9.65 | v17.02,49.28 v14.99,49.28
  Bottom 0.254: v22.81,23.92 22.81,23.32 22.1,22.61 21.59,22.61 19.05,25.15 19.05,37.08 14.99,41.15 14.99,46.48 | J2.3 14.99,51.04 v14.99,49.28 14.99,46.48 | v63.3,59.77 62.48,58.95 62.48,52.2 61.47,51.18 v36.62,51.18 18.03,51.18 17.02,50.16 v17.02,49.28 | v48.13,25.02 48.13,24.68 53.09,19.73 53.09,11.79 v55.22,9.65 | 14.99,46.48 14.92,46.42 TP9.P$1
SERVO_5V  (via drill 0.35)
  Bottom 0.254: v48.13,19.81 48.13,21.08 TP31.P$1
  Bottom 1.016: J3.P$2 47.45,16.59 48.13,17.27 v48.13,19.81
  other vias: 48.13,19.05 48.13,18.29 48.13,17.53
  pour Top (no thermals): 45.85,23.34 49.12,23.34 49.12,21.36 49.28,21.21 51.05,21.21 51.05,17.91 49.78,17.91 49.78,16.76 49.15,16.76 48.64,16.26 48.64,12.32 45.72,12.32 45.72,16.13 45.47,16.38 45.47,21.46 45.85,21.84
SERVO_POS  (via drill 0.35)
  Top 0.254: U1.32 25.46,31 26.68,32.22 29.17,32.22 v29.72,32.77 | v41.4,29.59 43.05,27.94 v43.05,22.61
  Bottom 0.254: v41.4,29.59 41.4,31.37 39.24,33.53 30.48,33.53 v29.72,32.77 30.39,32.1 TP39.P$1 | J3.P$4 43.74,21.67 43.05,22.35 v43.05,22.61
SERVO_PWM  (via drill 0.35)
  Top 0.254: R26.1 53.3,26.63 50.49,23.82 47.21,23.82 v47.19,23.79
  Bottom 0.254: J3.P$3 46.69,19.13 47.19,19.63 v47.19,23.79 47.19,23.82 TP20.P$1
TEMP_SENSOR_POWER  (via drill 0.35)
  Top 0.254: U1.25 26.6,27.5 v26.92,27.18 | U2.3 59.53,60.1 C10.1 59.35,60.12 58.17,58.93 v57.78,58.93 57.78,57.23 58.88,56.13 58.88,51.94 57.78,50.84 v57.78,50.44
  Power 0.254: v26.92,27.18 27.18,27.18 27.81,26.54 42.3,26.54 44.83,29.07 44.83,33.53 45.47,34.16 45.47,42.04 48.51,45.09 56.39,45.09 57.78,46.48 v57.78,50.44
  Bottom 0.254: TP35.P$1 57.53,59.18 v57.78,58.93
TX  (via drill 0.35)
  Top 0.254: v16.22,24.98 16.22,25.87 17.35,27 U1.10 | v34.38,12.76 35.12,12.76 36.1,13.75 Q3.3
  Bottom 0.254: v34.38,12.76 28.28,12.76 21.42,19.62 15.99,19.62 14.95,20.66 14.95,23.71 v16.22,24.98 16.22,25.68 TP1.P$1
USB_D+
  Top 0.305: R14.2 38.06,8.45 38.25,8.26 J1.B6 38.25,5.84 38.06,5.65 37.42,5.65 37.25,5.83 J1.A6
USB_D-
  Top 0.305: J1.B7 36.75,8.28 36.92,8.45 36.92,8.7 | 36.92,8.7 R13.2 | J1.A7 37.75,7.87 36.92,8.7
VBAT  (via drill 0.35)
  Top 0.254: R17.2 43.29,54.5 45.29,52.5 50.8,52.5
  Top 1.27: Q5.3 66.08,22.2 v66.73,22.85 | 50.8,52.5 51.6,53.3 J5.1
  Power 1.27: v66.73,22.85 68.73,24.85 68.73,36.35 71.12,38.73 71.12,42.42 70.1,43.44 65.29,43.44 60.52,48.22 60.52,51.68 58.9,53.3 J5.1
  Bottom 1.27: TP26.P$1 54.8,53.3 J5.1
  pour Top (no thermals): 50.42,52.69 50.42,48.4 51.18,48.4 51.18,52.69
VBAT_SENSE  (via drill 0.35)
  Top 0.254: U1.30 25.34,30 27.03,31.7 31.44,31.7 33.91,34.16 33.91,40.89 31.88,42.93 v31.88,45.72 31.88,49.4 33.02,50.55 34.81,50.55 40.93,56.66 R17.1 R18.1 C9.1
  Bottom 0.254: TP32.P$1 v31.88,45.72
VBUS  (via drill 0.35)
  Top 0.254: R3.2 28.83,25.65 31.11,23.37 v31.11,22.8
  Top 0.381: 31.5,9.91 31.59,9.81 D2.C
  Top 0.508: F1.1 33.26,9.91
  Top 0.559: J1.VBUS1 35.05,7.78 34.46,8.37 v34.29,8.37 | J1.VBUS2 39.95,7.69 v40.64,8.38
  Top 0.813: TC1.2 7.13,30.46 6.86,30.73 v5.84,30.73
  Top 1.27: v34.29,8.37 33.28,9.38 F1.1 | v30.48,9.91 31.5,9.91 33.26,9.91
  Power 0.254: v31.11,22.8 27.5,22.8 23.5,18.8 23.5,17.27 20.19,13.97
  Power 0.559: v34.29,8.37 34.3,8.38
  Power 1.27: 34.3,8.38 v40.64,8.38 | v5.84,30.73 7.62,30.73 9.55,28.8 9.55,24.61 20.19,13.97 22.71,11.45 28.93,11.45 v30.48,9.91
  Bottom 0.254: v30.48,9.91 30.48,9.49 TP7.P$1
VBUS_FUSED  (via drill 0.35, 0.4)
  Top 0.254: U8.VCC 33.24,19.27 v33.37,19.4 | v28.45,6.86 28.38,6.93 R1.1 | v45.97,9.91 45.97,9.53 49.28,6.22 49.28,5.33 48.77,4.83 46.74,4.83 45.16,3.25 LED9.+
  Top 0.508: C3.1 23.89,11.44 23.85,11.4 | R16.1 21.63,10.2 22.17,10.74 D1.A
  Top 0.61: v32.26,11.69 v32.26,11.68
  Top 0.813: F1.2 v32.26,11.69 | 22.17,11.99 D1.A
  Top 1.27: v25.65,12.9 25.65,12.19 24.86,11.4 23.85,11.4 22.76,11.4 22.17,11.99 | v64.3,27.1 Q5.1
  Power 0.254: v32.26,11.68 32.26,7.87 31.24,6.86 v28.45,6.86 | v33.37,19.4 33.37,18.01 32.13,16.76 24.13,16.76 22.35,14.99 22.35,13.97 23.42,12.9 v25.65,12.9
  Power 1.27: v25.65,12.9 25.78,13.03 30.91,13.03 v32.26,11.68 37.85,11.68 39.62,9.91 v45.97,9.91 47.88,11.81 59.02,11.81 64.3,17.09 v64.3,27.1 64.3,29.2 61.7,31.8 54.3,31.8 52.9,33.2 52.9,42.64 52.04,43.5 v51,43.5
  Bottom 0.254: v25.65,12.9 25.65,12.28 TP6.P$1
  other vias: 51.8,43.5 52.5,43.12
  pour Top (no thermals): 50.5,47.1 51.1,47.1 51.1,44.5 51.4,44.2 52.2,44.2 53.1,43.3 53.1,42.6 53,42.5 52.2,42.5 51.8,42.9 50.5,42.9
VBUS_SENSE  (via drill 0.35)
  Top 0.254: U1.37 22.3,33.48 23.37,34.54 v25.65,34.54 | v29.86,29.26 29.86,28.76 28.83,27.74 R3.1 R5.1 C2.1
  Bottom 0.254: v29.86,29.26 29.86,29.96 28.66,31.16 28.66,33.83 27.94,34.54 v25.65,34.54 26.29,33.91 TP33.P$1
VCC  (via drill 0.35)
  Top 0.254: v14.48,25.38 13.08,25.38 R8.2 | R15.1 24.18,36.07 v24.26,36.15 | Q10.1 9.64,41.46 R46.1 10.96,40.42 10.41,39.88 | Q9.1 9.65,37.65 R25.1 11.74,37.65 12.06,37.97 12.06,39.5 11.68,39.88 10.41,39.88 | v9.48,39.88 10.41,39.88 | R24.1 45.57,44.14 v43.39,44.14
  Top 0.305: v16.76,29.36 16.9,29.5 U1.5 | v22.38,34.44 21.8,33.87 U1.38 | U1.27 26.79,28.5 C4.1 26.89,29.18 27.18,29.46 v28.24,29.46 | U1.17 21.3,23.83 v19.87,22.41 20.09,22.19 R9.2 R10.2
  Top 0.508: R19.1 37.47,26.33 | 37.47,26.33 R20.1 | v37.47,27.43 37.47,26.33
  Top 0.61: U4.2 C1.1 | v41.41,45.79 41.41,46.54 U7.8_VCC U7.7_HOLD | U6.13 20.31,55.69 19.18,56.82 12.6,56.82 12.11,56.33 C7.2 11.93,51.56 v11.8,51.44 11.15,52.09 Q14.1 | v44.45,49.15 46.57,49.15 U7.3_WP
  Top 0.813: C1.1 22.56,17.09 C6.1 22.54,16.95 21.46,15.88 v20.7,15.88
  Power 0.254: v24.26,36.15 24.26,35.43 23.27,34.44 v22.38,34.44
  Power 0.61: 14.48,28.45 15.39,29.36 v16.76,29.36 | 14.48,28.45 v14.48,25.38 14.48,24.38 15.24,23.62 17.02,23.62 18.23,22.41 v19.87,22.41 22.35,22.41 | 14.48,28.45 14.48,30.99 9.48,35.98 v9.48,39.88 9.48,43.52 11.18,45.21 11.18,50.81 v11.8,51.44 | 22.35,22.41 22.35,22.61 22.61,22.61 23.62,23.62 23.62,28.19 24.89,29.46 v28.24,29.46 28.24,30.69 27.81,31.11 | 22.35,22.41 22.35,17.53 v20.7,15.88 | 27.81,31.11 24.49,34.44 v22.38,34.44 | v44.45,49.15 44.45,47.62 43.57,46.74 42.35,46.74 v41.41,45.79 41.41,44.07 | 33.53,31.11 35.06,32.64 35.06,36.96 41.41,43.31 41.41,44.07 | 27.81,31.11 33.53,31.11 | 33.53,31.11 33.53,29.08 34.29,28.32 37.08,28.32 37.47,27.94 v37.47,27.43 | v43.39,44.14 41.48,44.14 41.41,44.07
  Bottom 0.254: TP12.P$1 9.48,40.27 v9.48,39.88 | TP14.P$1 43.93,49.67 v44.45,49.15
VIN  (via drill 0.35, 0.4)
  Top 0.254: C8.1 18.42,15.69 18.47,15.64 | Q11.2 47.3,36.02 R50.1
  Top 0.813: C8.1 18.47,15.52
  Top 1.27: U4.3 18.47,15.64 | 18.47,15.52 18.47,14.61 | 18.47,14.61 D1.C | v23.5,14.61 18.47,14.61 | Q5.2 v62.4,27.1 | v49.5,33.9 50.14,34.54 Q11.2
  Power 1.27: v23.5,14.61 24.46,15.57 27.99,15.57 29.01,14.55 34.62,14.55 37.85,17.78 41.78,17.78 45.85,13.72 57.84,13.72 62.4,18.28 v62.4,27.1 60.1,29.4 53.3,29.4 49.5,33.2 v49.5,33.9
  Bottom 0.254: TP23.P$1 23.01,14.12 v23.5,14.61
VIN+
  Top 0.254: R41.2 C25.1 53.47,16.64 53.85,16.26 55.5,16.26 56.22,15.54 U11.1
VIN-
  Top 0.254: R42.2 C25.2 52.45,16.26 52.96,15.75 55.24,15.75 55.57,15.42 U11.2

## Text on the board
tPlace: BORC | Control Board | v2.2 / 2024-05-12 | Reset
bPlace: LED display -> | <- Servo | Designed by Akram Ali